# EAGLE design RS485 board with pins (EAGLE 7.7.0)
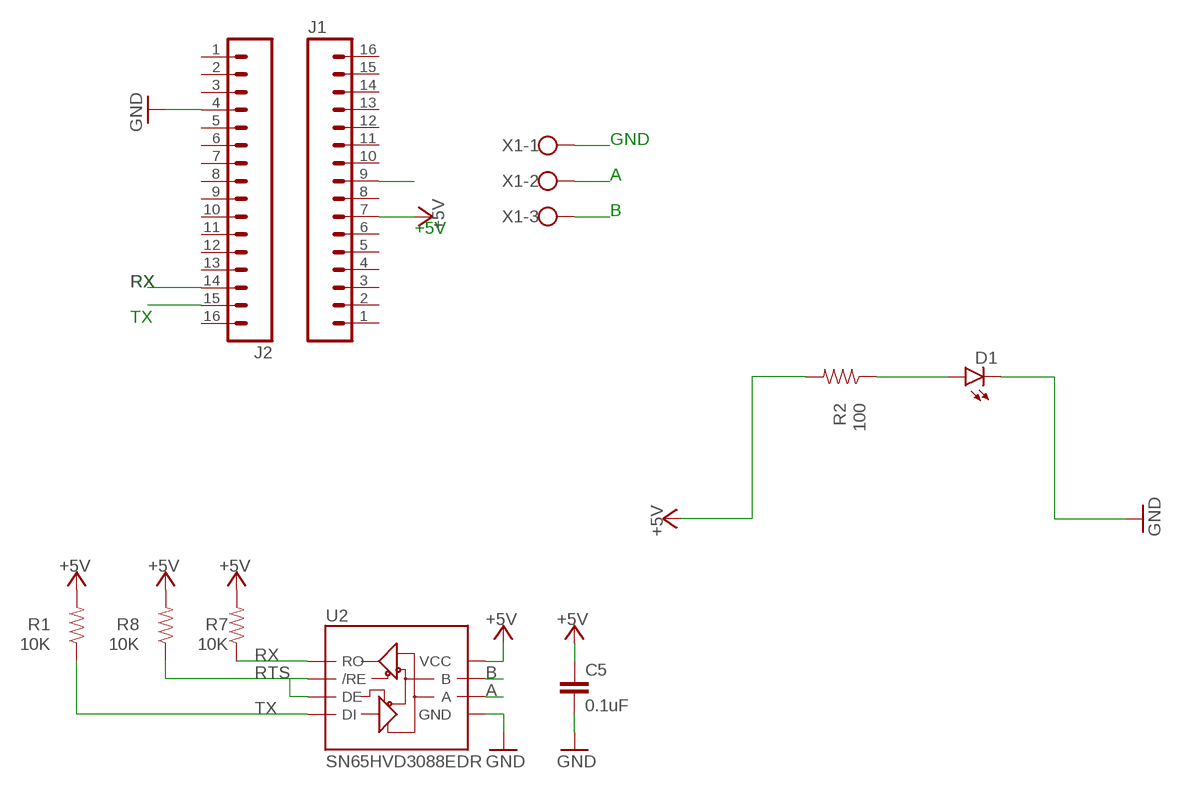
[diagram p0: schematic, sheet 1]

## Parts
C5  0.1uF  0.1UF-25V(+80/-20%)(0603)  [0603-CAP]
D1  LED-FKIT-1206  [FKIT-LED-1206]
J1  M16LOCK  [1X16_LOCK]
J2  M16LOCK  [1X16_LOCK]
R1  10K  RESISTOR0603  [0603-RES]
R2  100  RESISTOR0603  [0603-RES]
R7  10K  RESISTOR0603  [0603-RES]
R8  10K  RESISTOR0603  [0603-RES]
U2  SN65HVD3088EDR  RS485SOIC  [SO08]
X1  W237-103  [W237-103]

## Nets
+5V: C5.1 J1.7 R1.2 R2.2 R7.2 R8.2 U2.8(VCC)
A: U2.6(A) X1.2
B: U2.7(B) X1.3
GND: C5.2 D1.C J2.4 U2.5(GND) X1.1
N$4: D1.A R2.1
RTS: J1.9 R8.1 U2.2(/RE) U2.3(DE)
RX: J2.14 R7.1 U2.1(RO)
TX: J2.15 R1.1 U2.4(DI)
Unconnected: J1.1 J1.2 J1.3 J1.4 J1.5 J1.6 J1.8 J1.10 J1.11 J1.12 J1.13 J1.14 J1.15 J1.16 J2.1 J2.2 J2.3 J2.5 J2.6 J2.7 J2.8 J2.9 J2.10 J2.11 J2.12 J2.13 J2.16

## Notes on the sheet
- GND
- A
- B
- +5V
- RX
- TX

## Library data of the parts
C5 = SparkFun-Capacitors:0.1UF-25V(+80/-20%)(0603): CAP-00810 Ceramic Standard decoupling cap; PROD_ID: CAP-00810
D1 = SparkFun-LED:LED: LEDs Standard schematic elements and footprints for 5mm, 3mm, 1206, and 0603 sized LEDs. 5mm - Spark Fun Electronics SKU : COM-00529 (and others)
J1 J2 = SparkFun-Connectors:M16: 1x16 .1" header
R1 R2 R7 R8 = SparkFun-Resistors:RESISTOR: Resistor Basic schematic elements and footprints for 0603, 1206, and PTH resistors.
U2 = SparkFun:RS485
X1 = con-wago-500:W237-103: WAGO SCREW CLAMP; MPN: 237-103; OC_FARNELL: unknown; OC_NEWARK: 18M7116

## Net classes
0 default: width 0.203 mm

## Board
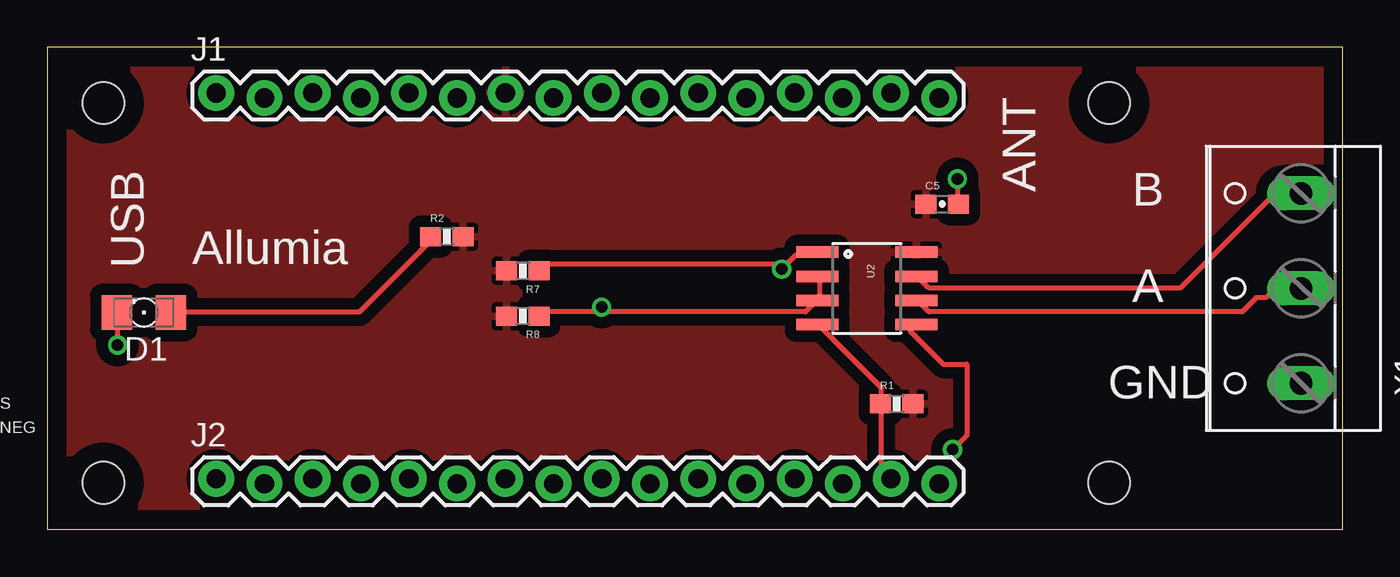
[diagram p1: board, top side]
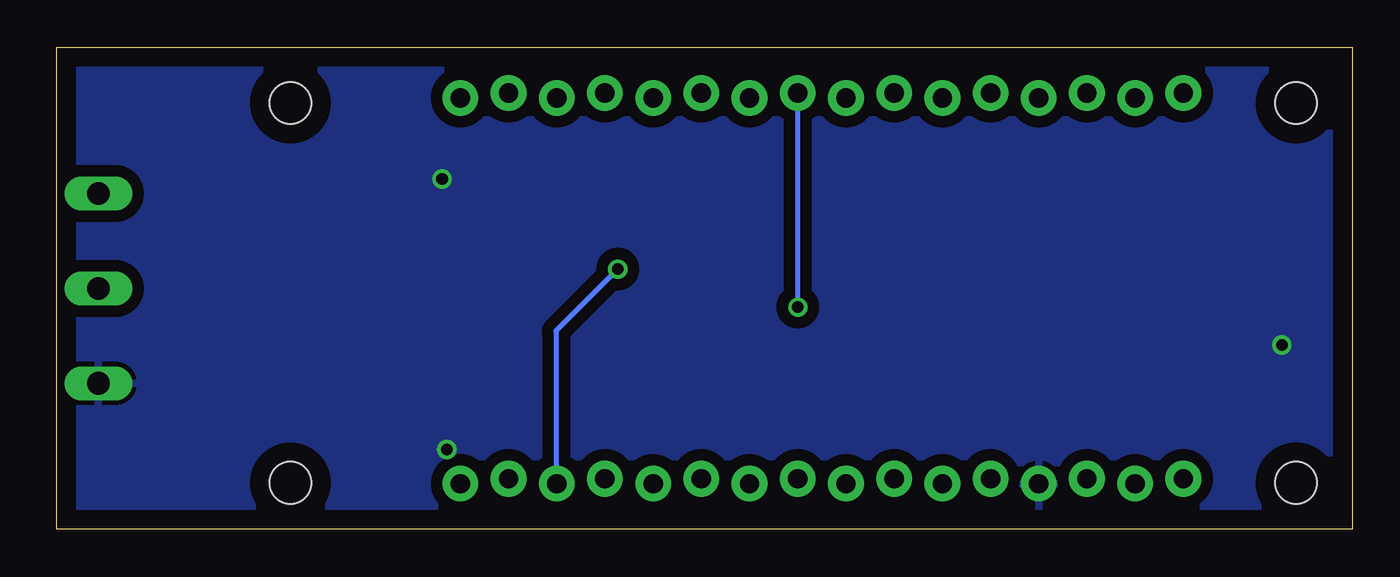
[diagram p2: board, bottom side, seen from below]

Size 68.25 x 25.39 mm. Coordinates in mm from the lower left corner, seen from the top.
Outline: 0,0 68.25,0 68.25,25.39 0,25.39 0,0
Copper layers (1*16): Top 0.035mm / dielectric 1.5mm / Bottom 0.035mm
Design rules "default": minimum track width 10mil, minimum drill 24mil, track to track 8mil, track to pad 8mil, pad to pad 8mil, via to via 8mil, smd to smd 8mil, copper to edge 40mil, drill to drill 8mil, minimum pad ring 10mil, minimum via ring 8mil, stop-mask expansion 4mil, vias tented up to drill 0mil, thermal gap 10mil
Holes 2.2 mm at 55.95,2.46 2.95,2.46 2.95,22.46 55.95,22.46

### Footprints (pad centres in the part's own frame; a part is rotated, then mirrored left to right if it is on the bottom)
0603-CAP = smd 1.1 x 1: 1 -0.85,0; 2 0.85,0
FKIT-LED-1206 = smd 1.6 x 1.803: A -1.422,0; C 1.422,0
1X16_LOCK = drill 1.016 pad 1.88: 1 0,0.127; 2 2.54,-0.127; 3 5.08,0.127; 4 7.62,-0.127; 5 10.16,0.127; 6 12.7,-0.127; 7 15.24,0.127; 8 17.78,-0.127; 9 20.32,0.127; 10 22.86,-0.127; 11 25.4,0.127; 12 27.94,-0.127; 13 30.48,0.127; 14 33.02,-0.127; 15 35.56,0.127; 16 38.1,-0.127
0603-RES = smd 1.1 x 1: 1 -0.85,0; 2 0.85,0
SO08 = smd 0.61 x 2.21: 1 -1.905,-2.616; 2 -0.635,-2.616; 3 0.635,-2.616; 4 1.905,-2.616; 5 1.905,2.616; 6 0.635,2.616; 7 -0.635,2.616; 8 -1.905,2.616
W237-103 = drill 1.194 long: 1 -5,-1.29; 2 0,-1.29; 3 5,-1.29

### Placement (x,y rotation side)
C5  47.15,17.14 0 top
D1  5.08,11.43 180 top
J1  8.89,22.86 0 top
J2  8.89,2.54 0 top
R1  44.75,6.62 0 top
R2  21.05,15.43 0 top
R7  25.05,13.62 180 top
R8  25.05,11.24 180 top
U2  43.18,12.7 270 top
X1  64.77,12.7 90 top

### Tracks (layer width: path | path; a pad name or v marks a point on that pad's centre or on a via)
+5V
  pour Top (isolate 0.61): 0,25.4 68.58,25.4 68.58,0 0,0
A
  Top 0.254: U2.6 45.95,11.96 46.45,11.46 62.95,11.46 63.7,12.21 64.2,12.21 64.45,12.46 65.95,12.46 X1.2
B
  Top 0.254: U2.7 45.95,13.21 46.45,12.71 59.7,12.71 64.45,17.46 65.95,17.46 X1.3
GND  (via drill 0.61)
  Top 0.254: v47.95,18.46 47.95,17.21 C5.2 | v47.7,4.21 48.45,4.96 48.45,8.71 47.2,8.71 45.45,10.46 45.45,10.71 45.7,10.71 U2.5 | v3.7,9.71 3.7,11.21 D1.C
  pour Bottom (isolate 0.61): 0,0 0,25.4 68.58,25.4 68.58,0
N$4
  Top 0.254: R2.1 20.2,15.21 16.45,11.46 6.7,11.46 D1.A
RTS  (via drill 0.61)
  Top 0.254: 29.2,11.46 39.95,11.46 40.45,11.96 U2.3 40.7,12.21 40.7,13.21 U2.2 | 29.2,11.46 25.95,11.46 R8.1 | 29.2,11.46 v29.2,11.71
  Bottom 0.254: v29.2,11.71 29.2,22.96 J1.9
RX  (via drill 0.61)
  Top 0.254: 38.7,13.96 38.95,13.96 39.45,14.46 40.45,14.46 U2.1 | 38.7,13.96 26.2,13.96 25.95,13.71 R7.1 | 38.7,13.96 v38.7,13.71
  Bottom 0.254: v38.7,13.71 41.95,10.46 41.95,2.46 J2.14
TX
  Top 0.254: J2.15 44.45,2.71 43.95,2.71 43.95,6.46 R1.1 43.95,6.71 43.95,7.46 40.7,10.71 U2.4

### Text on the board
tPlace: ANT | B | Allumia | USB | A | GND
_tsilk: POS | NEG